# EasyEDA Pro project 舵机连接板_1.27mm.eprj

# Schematic Schematic2
Create Date: 2023-04-18; Page Name: P1; Project Name: 舵机连接板_1.27mm; Schematic Name: Schematic2; Update Date: 2023-04-18; Company: SakuraFue; Page Size: A4; Version: V1.0
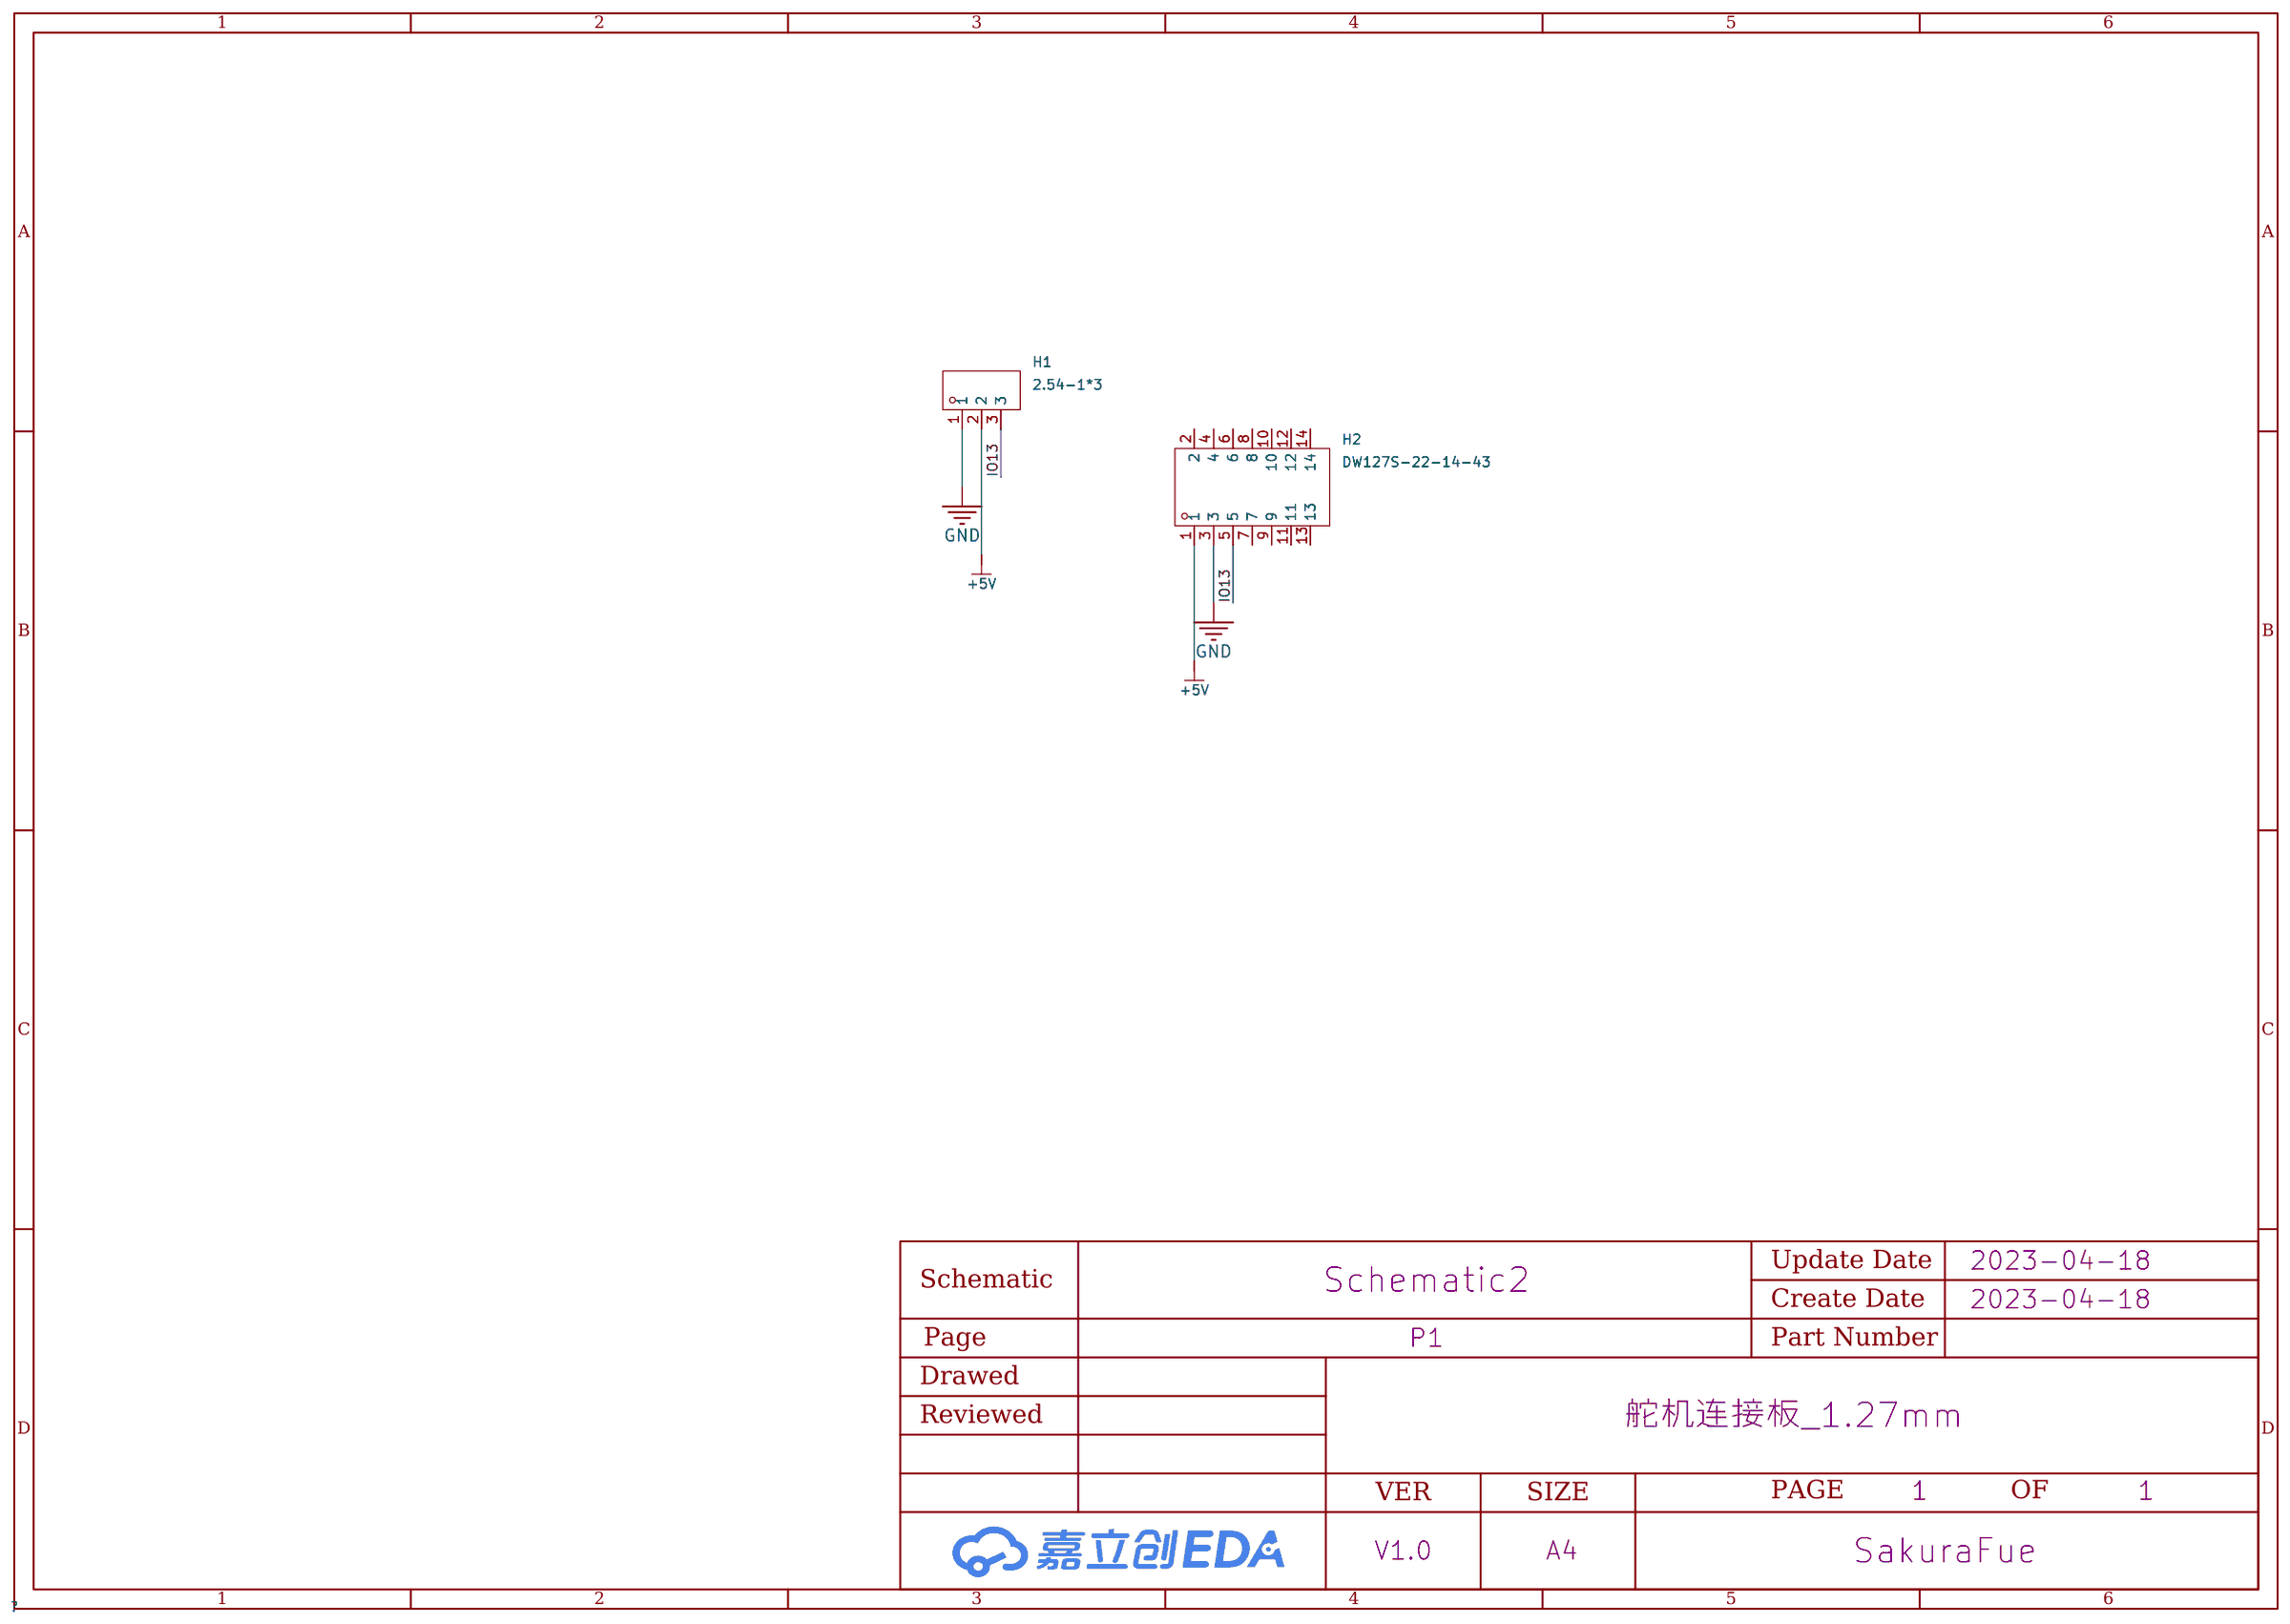
[diagram p0: schematic sheet]

## Parts
H1  2.54-1*3  [HDR-TH_3P-P2.54-V-M-1]
H2  DW127S-22-14-43  [HDR-SMD_14P-P1.27-V-F-R2-C7-LS4.8]

## Library data of the parts
H1 = 2.54-1*3: 排针 2.54mm 1x3P 镀金3u; LCSC Part Name: 排针 2.54mm 1x3P 镀金3u; Supplier Part: C5116482; Manufacturer: ZHOURI(洲日); Supplier Footprint: 插件,P=2.54mm; JLCPCB Part Class: Extended Part; Datasheet: https://atta.szlcsc.com/upload/public/pdf/source/20220729/4DB71EF9013296CFACD97372BAB8A1F0.pdf; Supplier: LCSC
H2 = DW127S-22-14-43: 排数:双排;总孔位数:14;间距:1.27mm;插孔结构:2x7P;安装类型:立贴;; LCSC Part Name: 1.27mm 2x7P; Supplier Part: C5160804; Manufacturer: DEALON(德艺隆); Supplier Footprint: SMD,P=1.27mm; JLCPCB Part Class: Extended Part; Datasheet: https://atta.szlcsc.com/upload/public/pdf/source/20220914/3CEDA3554470344F3AE280224D559ADE.pdf; Supplier: LCSC; Number of Rows: 双排; Number of Holes: 14; Pitch: 1.27mm; Holes Structure: 2x7P; Mounting Type: 立贴

## Nets
+5V: H1.2 H2.1
GND: H1.1 H2.3
IO13: H1.3 H2.5

Not connected (* = marked no-connect by the designer): H2 2 4 6 7 8 9 10 11 12 13 14

# Board PCB5
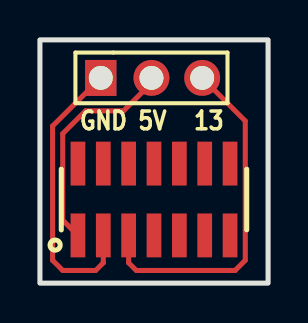
[diagram p1: board, top side]
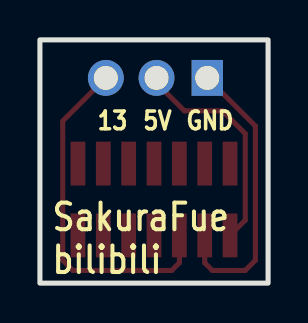
[diagram p2: board, bottom side, seen from below]

Outline 11.43 x 12.19 mm; copper layers: Top Layer, Bottom Layer. Coordinates in mm from the lower left corner of the outline.
Outline path: rectangle 0,12.19 11.43,0
Stack: Top Layer 0.035mm / Dielectric1 1.51mm FR4 er 4.5 / Bottom Layer 0.035mm

## Design rules (mm)
spacing safeClearance (default): track to track 0.152, other pairs 0.152 to 0.3
track width trackWidth (default): min 0.127, default 0.254, max 2.54
differential pair differentialPair (default): width min 0.127, default 0.254, max 2.54; gap min 0.152, default 0.152
via viaSize (default): diameter min 0.5, default 0.61, max 10; hole min 0.3, default 0.305, max 6

## Placement (name value [footprint] x y rotation side)
GND  2.54-1*3  [HDR-TH_3P-P2.54-V-M-1]  5.59 10.29 0 top
H2  DW127S-22-14-43  [HDR-SMD_14P-P1.27-V-F-R2-C7-LS4.8]  5.72 4.19 0 top

## Footprints (pads in the part's own frame, mm; a bottom-side part is the same pattern mirrored in y, then rotated)
HDR-SMD_14P-P1.27-V-F-R2-C7-LS4.8
  rect 0.74x2.2 smd: 1(-3.81,-1.8) 2(-3.81,1.8) 3(-2.54,-1.8) 4(-2.54,1.8) 5(-1.27,-1.8) 6(-1.27,1.8) 7(0,-1.8) 8(0,1.8) 9(1.27,-1.8) 10(1.27,1.8) 11(2.54,-1.8) 12(2.54,1.8) 13(3.81,-1.8) 14(3.81,1.8)
HDR-TH_3P-P2.54-V-M-1
  rect 1.575x1.8 hole 1.2: 1(-2.54,0)
  round 1.8 hole 1.2: 2(0,0) 3(2.54,0)

## Nets
+5V: GND.2 H2.1
GND: GND.1 H2.3
IO13: GND.3 H2.5

Pads without a net: H2 2 4 6 7 8 9 10 11 12 13 14

## Routing (per net, layer and track width the routed paths; a pad name or vN(x,y) marks a point on that pad's centre or on a via; arc(x,y) is an arc through that point)
+5V: length 11.2
  Top Layer w0.254: GND.2 5.59,10.03 4.19,8.64 2.29,8.64 1.14,7.49 1.14,3.15 H2.1
GND: length 14.4
  Top Layer w0.254: H2.3 3.18,1.02 2.79,0.64 1.14,0.64 0.63,1.14 0.63,7.87 GND.1
IO13: length 17.6
  Top Layer w0.254: H2.5 4.44,1.02 4.83,0.64 9.78,0.64 10.29,1.14 10.29,8.13 GND.3

## Text on the board
Bottom Silkscreen Layer: GND | 5V | 13 | SakuraFue / bilibili
Top Silkscreen Layer: GND | 5V | 13
